# Altium schematic sheet sheet_gant.SchDoc
size A4; SheetNumber: 1; SheetTotal: 1
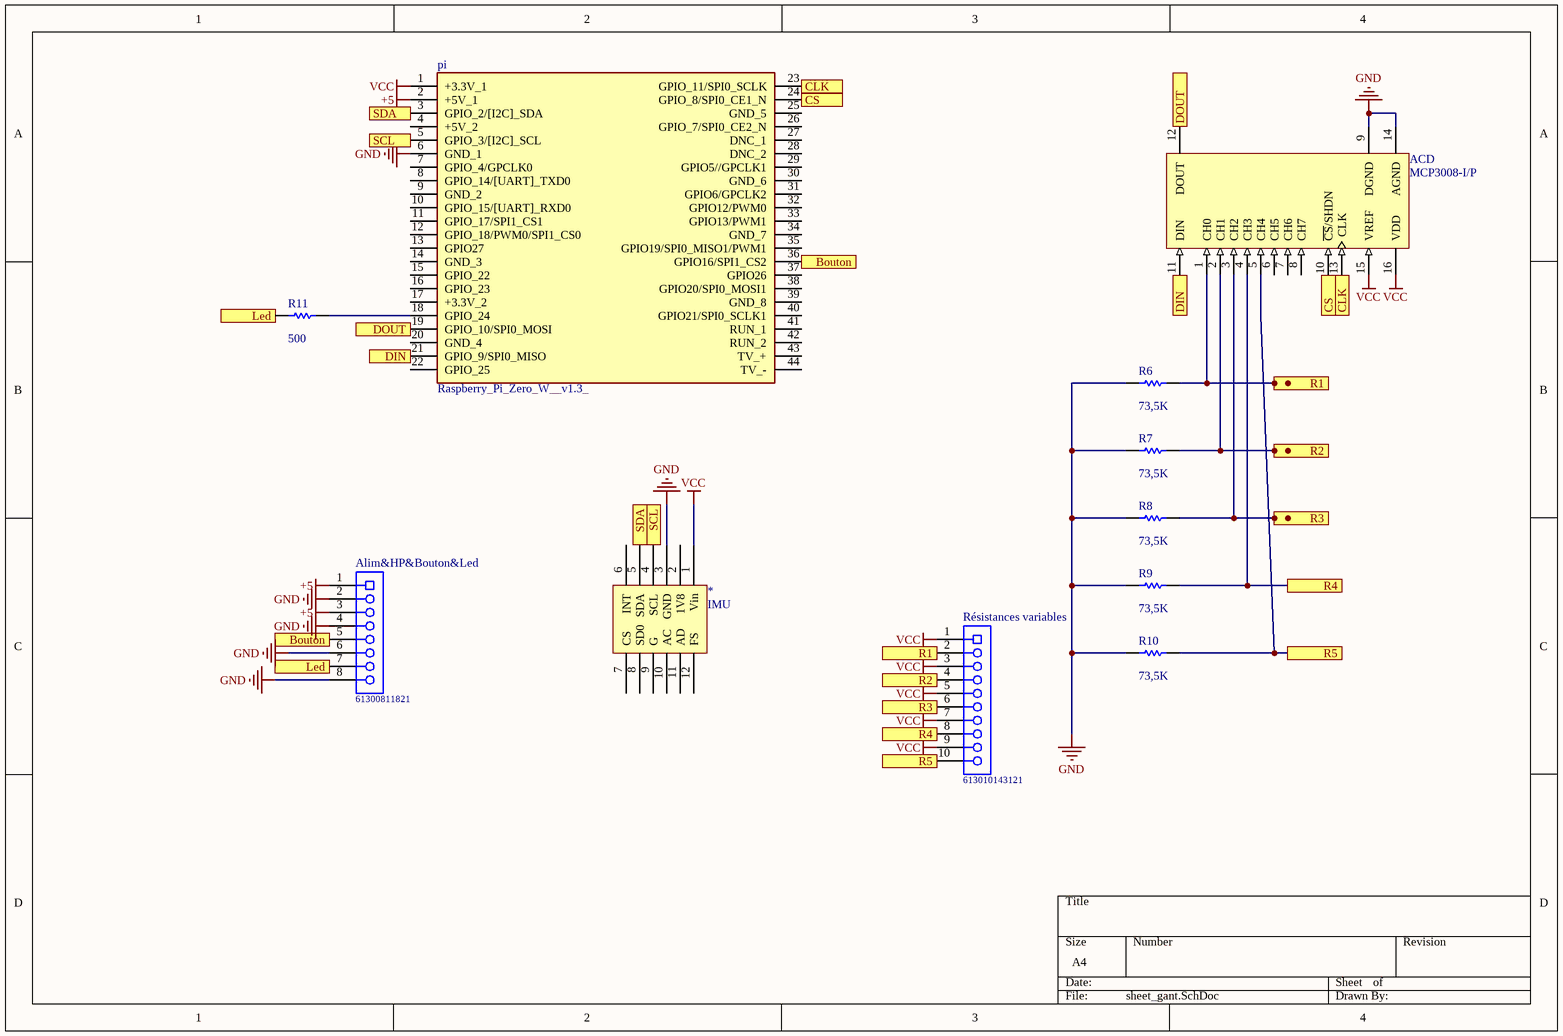
[diagram p0: sheet_gant.SchDoc]

## Parts
*  IMU  [IMU20948]
ACD  MCP3008-I/P  [PDIP300-P16]
Alim&HP&Bouton&Led  61300811821  [61300811821]
pi  Raspberry_Pi_Zero_W__v1.3_  [RASPBERRYPIZEROWV13]
R6  value 73,5K  [C1206]
R7  value 73,5K  [C1206]
R8  value 73,5K  [C1206]
R9  value 73,5K  [C1206]
R10  value 73,5K  [C1206]
R11  value 500  [C1206]
Résistances_variables  613010143121  [613010143121]

## Ports
Bouton, CLK, CS, DIN, DOUT, Led, R1, R2, R3, R4, R5, SCL, SDA

## Nets
+5: Alim&HP&Bouton&Led.1 Alim&HP&Bouton&Led.3 pi.2(+5V_1)
GND: *.3(GND) ACD.9(DGND) ACD.14(AGND) Alim&HP&Bouton&Led.2 Alim&HP&Bouton&Led.4 Alim&HP&Bouton&Led.6 Alim&HP&Bouton&Led.8 pi.6(GND_1) R6.1 R7.1 R8.1 R9.1 R10.1
VCC: *.1(Vin) ACD.15(VREF) ACD.16(VDD) pi.1(+3.3V_1) Résistances_variables.1 Résistances_variables.3 Résistances_variables.5 Résistances_variables.7 Résistances_variables.9
Bouton: Alim&HP&Bouton&Led.5 pi.36(GPIO16/SPI1_CS2) ; port Bouton
CLK: ACD.13(CLK) pi.23(GPIO_11/SPI0_SCLK) ; port CLK
CS: ACD.10(~{CS}/SHDN) pi.24(GPIO_8/SPI0_CE1_N) ; port CS
DIN: ACD.11(DIN) pi.21(GPIO_9/SPI0_MISO) ; port DIN
DOUT: ACD.12(DOUT) pi.19(GPIO_10/SPI0_MOSI) ; port DOUT
Led: Alim&HP&Bouton&Led.7 R11.1 ; port Led
R1: ACD.1(CH0) R6.2 Résistances_variables.2 ; port R1
R2: ACD.2(CH1) R7.2 Résistances_variables.4 ; port R2
R3: ACD.3(CH2) R8.2 Résistances_variables.6 ; port R3
R4: ACD.4(CH3) R9.2 Résistances_variables.8 ; port R4
R5: ACD.5(CH4) R10.2 Résistances_variables.10 ; port R5
SCL: *.4(SCL) pi.5(GPIO_3/[I2C]_SCL) ; port SCL
SDA: *.5(SDA) pi.3(GPIO_2/[I2C]_SDA) ; port SDA
Netpi_18: pi.18(GPIO_24) R11.2

Not connected (* = marked no-connect by the designer): * 2(1V8) 6(INT) 7(CS) 8(SD0) 9(G) 10(AC) 11(AD) 12(FS); ACD 6(CH5) 7(CH6) 8(CH7); pi 4(+5V_2) 7(GPIO_4/GPCLK0) 8(GPIO_14/[UART]_TXD0) 9(GND_2) 10(GPIO_15/[UART]_RXD0) 11(GPIO_17/SPI1_CS1) 12(GPIO_18/PWM0/SPI1_CS0) 13(GPIO27) 14(GND_3) 15(GPIO_22) 16(GPIO_23) 17(+3.3V_2) 20(GND_4) 22(GPIO_25) 25(GND_5) 26(GPIO_7/SPI0_CE2_N) 27(DNC_1) 28(DNC_2) 29(GPIO5//GPCLK1) 30(GND_6) 31(GPIO6/GPCLK2) 32(GPIO12/PWM0) 33(GPIO13/PWM1) 34(GND_7) 35(GPIO19/SPI0_MISO1/PWM1) 37(GPIO26) 38(GPIO20/SPI0_MOSI1) 39(GND_8) 40(GPIO21/SPI0_SCLK1) 41(RUN_1) 42(RUN_2) 43(TV_+) 44(TV_-)

## Library data of the parts
* = Component_1
ACD = CMP-0188-00184-2: 2.7V 4-Channel/8-Channel 10-Bit A/D Converters with SPI Serial Interface, 16-Pin PDIP, Industrial Temperature; ComponentLink1URL: http://www.microchip.com/; ComponentLink2URL: http://ww1.microchip.com/downloads/en/DeviceDoc/21295d.pdf; PackageVersion: revBB, Aug-2009; ComponentLink3URL: http://www.microchip.com/stellent/groups/techpub_sg/documents/packagingspec/en012702.pdf; DatasheetVersion: revD, Dec-2008; PackageDescription: 16-Lead Plastic Dual In-Line (P) - 300 mil Body [PDIP]; ComponentLink3Description: Package Specification; Code_JEDEC: MS-001-BB; ComponentLink1Description: Manufacturer URL; RevisionNote: URLs added.; PackageReference: PDIP300-P16; ComponentLink2Description: Datasheet
Alim&HP&Bouton&Led = CMP-1502-01327-1: THT Vertical Socket Header WR-PHD, Pitch 2.54 mm, Single Row, 8 pins; Manufacturer: Wurth Elektronik; Gender: Female; Pin Number: 8; Withstanding Voltage: 500VAC; Pitch: 2.54mm; Contact Resistance: 20mOhm; Working Voltage: 250VAC; Rated Current: 3A; Mounting Technology: THT; Manufacturer URL: http://www.we-online.de; Package Reference: 61300811821; Orientation: Vertical; Datasheet URL: https://katalog.we-online.de/em/datasheet/6130xx11821.pdf; Row Number: Single; Packaging: Tray; Part Number: 61300811821; Publisher: WurthElektronik; Operating Temperature: -40to125degC
pi = Raspberry_Pi_Zero_W__v1.3_: Integrated Circuit; Manufacturer_Name: RASPBERRY-PI; Manufacturer_Part_Number: Raspberry Pi Zero W (v1.3); Datasheet Link: https://cdn.sparkfun.com/assets/learn_tutorials/6/7/6/PiZero_1.pdf
R6-R11 = Res1: Resistor; Published: 8-Jun-2000; LatestRevisionDate: 17-Jul-2002; LatestRevisionNote: Re-released for DXP Platform.; PackageReference: AXIAL-0.3; Publisher: Altium Limited; PackageDescription: Axial Device, Thru-Hole; 2 Leads; 0.3 in Pin Spacing
Résistances_variables = CMP-1502-01419-1: THT Angled Socket Header WR-PHD, Pitch 2.54 mm, Single Row, 10 pins; Manufacturer: Wurth Elektronik; Rated Current: 3A; Pin Number: 10; Working Voltage: 250VAC; Withstanding Voltage: 500VAC; Contact Resistance: 20mOhm; Pitch: 2.54mm; Gender: Female; Mounting Technology: THT; Packaging: Tray; Manufacturer URL: http://www.we-online.de; Operating Temperature: -40to125degC; Orientation: Angled; Datasheet URL: https://katalog.we-online.de/em/datasheet/6130xx143121.pdf; Package Reference: 613010143121; Row Number: Single; Publisher: WurthElektronik; Part Number: 613010143121